# EAGLE design tick-display-mk-2.3-mini (EAGLE 6.5.0)
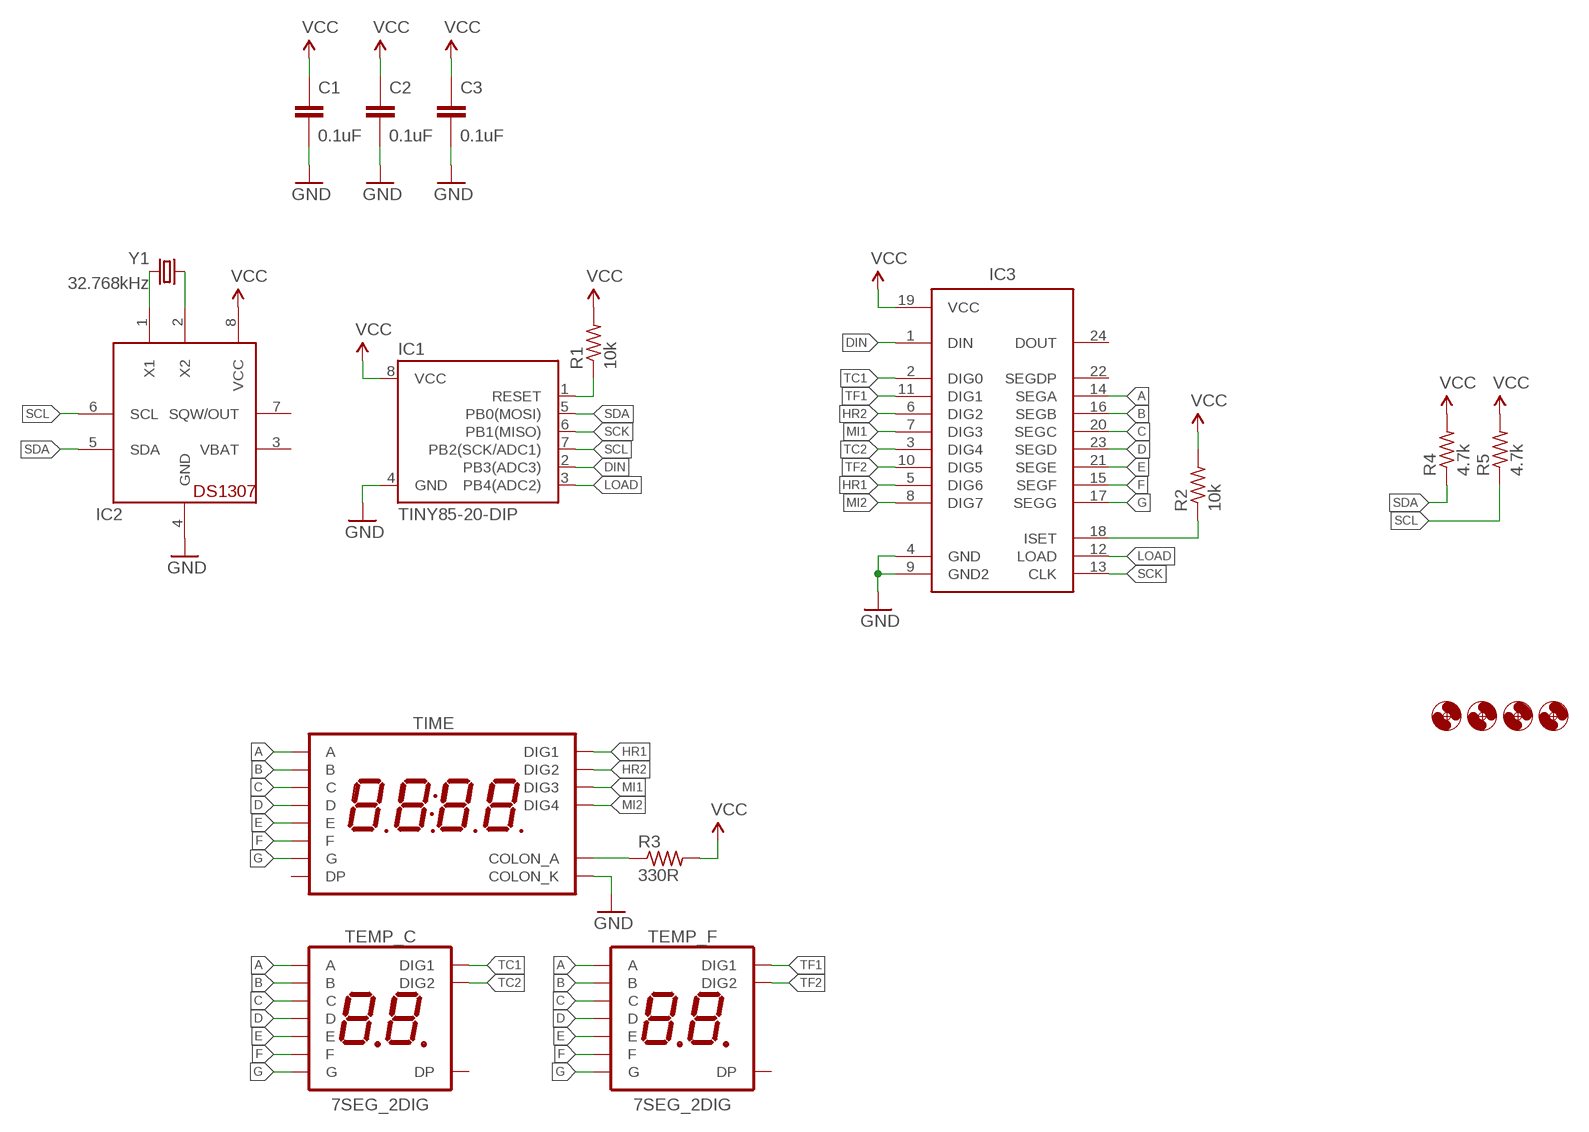
[diagram p0: schematic, sheet 1]

## Parts
C1  0.1uF  CAPACITOR-CERAMIC025-024X044  [C025-024X044]
C2  0.1uF  CAPACITOR-CERAMIC025-024X044  [C025-024X044]
C3  0.1uF  CAPACITOR-CERAMIC025-024X044  [C025-024X044]
H1  HOLE#2  [HOLE-#2]
H2  HOLE#2  [HOLE-#2]
H3  HOLE#2  [HOLE-#2]
H4  HOLE#2  [HOLE-#2]
IC1  TINY85-20-DIP  ATTINY45TINY85-20-DIP  [DIP08]
IC2  DS1307  [DIL08]
IC3  MAX7219DIP  [DIL24]
R1  10k  RESISTORPTH-AXIAL-5.08MM  [RESISTOR-AXIAL-PTH-5.08MM]
R2  10k  RESISTORPTH-AXIAL-5.08MM  [RESISTOR-AXIAL-PTH-5.08MM]
R3  330R  RESISTORPTH-AXIAL-5.08MM  [RESISTOR-AXIAL-PTH-5.08MM]
R4  4.7k  RESISTORPTH-AXIAL-5.08MM  [RESISTOR-AXIAL-PTH-5.08MM]
R5  4.7k  RESISTORPTH-AXIAL-5.08MM  [RESISTOR-AXIAL-PTH-5.08MM]
TEMP_C  7SEG_2DIG  [7SEG_2DIG_14MM]
TEMP_F  7SEG_2DIG  [7SEG_2DIG_14MM]
TIME  7SED_4DIGIT_14MM14.2MM-CC  [7SEG_4DIG]
Y1  32.768kHz  CRYSTALTC26H  [TC26H]

## Nets
A: IC3.14(SEGA) TEMP_C.4(A) TEMP_F.4(A) TIME.P$13(A)
B: IC3.16(SEGB) TEMP_C.3(B) TEMP_F.3(B) TIME.P$9(B)
C: IC3.20(SEGC) TEMP_C.9(C) TEMP_F.9(C) TIME.P$4(C)
D: IC3.23(SEGD) TEMP_C.8(D) TEMP_F.8(D) TIME.P$2(D)
DIN: IC1.2(PB3(ADC3)) IC3.1(DIN)
E: IC3.21(SEGE) TEMP_C.6(E) TEMP_F.6(E) TIME.P$1(E)
F: IC3.15(SEGF) TEMP_C.7(F) TEMP_F.7(F) TIME.P$12(F)
G: IC3.17(SEGG) TEMP_C.1(G) TEMP_F.1(G) TIME.P$5(G)
GND: C1.2 C2.2 C3.2 IC1.4(GND) IC2.4(GND) IC3.4(GND) IC3.9(GND2) TIME.P$7(COLON_K)
HR1: IC3.5(DIG6) TIME.P$14(DIG1)
HR2: IC3.6(DIG2) TIME.P$11(DIG2)
LOAD: IC1.3(PB4(ADC2)) IC3.12(LOAD)
MI1: IC3.7(DIG3) TIME.P$10(DIG3)
MI2: IC3.8(DIG7) TIME.P$6(DIG4)
N$2: IC3.18(ISET) R2.P$1
N$4: IC1.1(RESET) R1.P$1
N$7: IC2.1(X1) Y1.2
N$8: IC2.2(X2) Y1.1
N$18: R3.P$1 TIME.P$8(COLON_A)
SCK: IC1.6(PB1(MISO)) IC3.13(CLK)
SCL: IC1.7(PB2(SCK/ADC1)) IC2.6(SCL) R5.P$1
SDA: IC1.5(PB0(MOSI)) IC2.5(SDA) R4.P$1
TC1: IC3.2(DIG0) TEMP_C.5(DIG1)
TC2: IC3.3(DIG4) TEMP_C.10(DIG2)
TF1: IC3.11(DIG1) TEMP_F.5(DIG1)
TF2: IC3.10(DIG5) TEMP_F.10(DIG2)
VCC: C1.1 C2.1 C3.1 IC1.8(VCC) IC2.8(VCC) IC3.19(VCC) R1.P$2 R2.P$2 R3.P$2 R4.P$2 R5.P$2
Unconnected: IC2.7(SQW/OUT) IC3.22(SEGDP) IC3.24(DOUT) TEMP_C.2(DP) TEMP_F.2(DP) TIME.P$3(DP)

## Power pins joined to a net without a drawn wire
VBAT: IC2.3(VBAT)

## Library data of the parts
C1-C3 = A_butts:CAPACITOR-CERAMIC: CAPACITOR, European symbol
H1-H4 = A_butts:HOLE: MOUNTING HOLE with drill center marker
IC1 = A_butts:ATTINY45: Atmel 8-pin 2/4/8kB flash uC; PROD_ID: IC-09445
IC2 = A_butts:DS1307: DS1307 Real time clock (RTC) with battery backup ability. Talk to it via i2c
IC3 = A_butts:MAX7219: 8-digit, 8-segment LED display driver, serial input
R1-R5 = A_butts:RESISTOR: RESISTOR, American symbol
TEMP_C TEMP_F = A_butts:7SEG_2DIG
TIME = A_butts:7SED_4DIGIT_14MM
Y1 = A_butts:CRYSTAL: Various standard crystals. Proven footprints. Spark Fun Electronics SKU : COM-00534

## Board
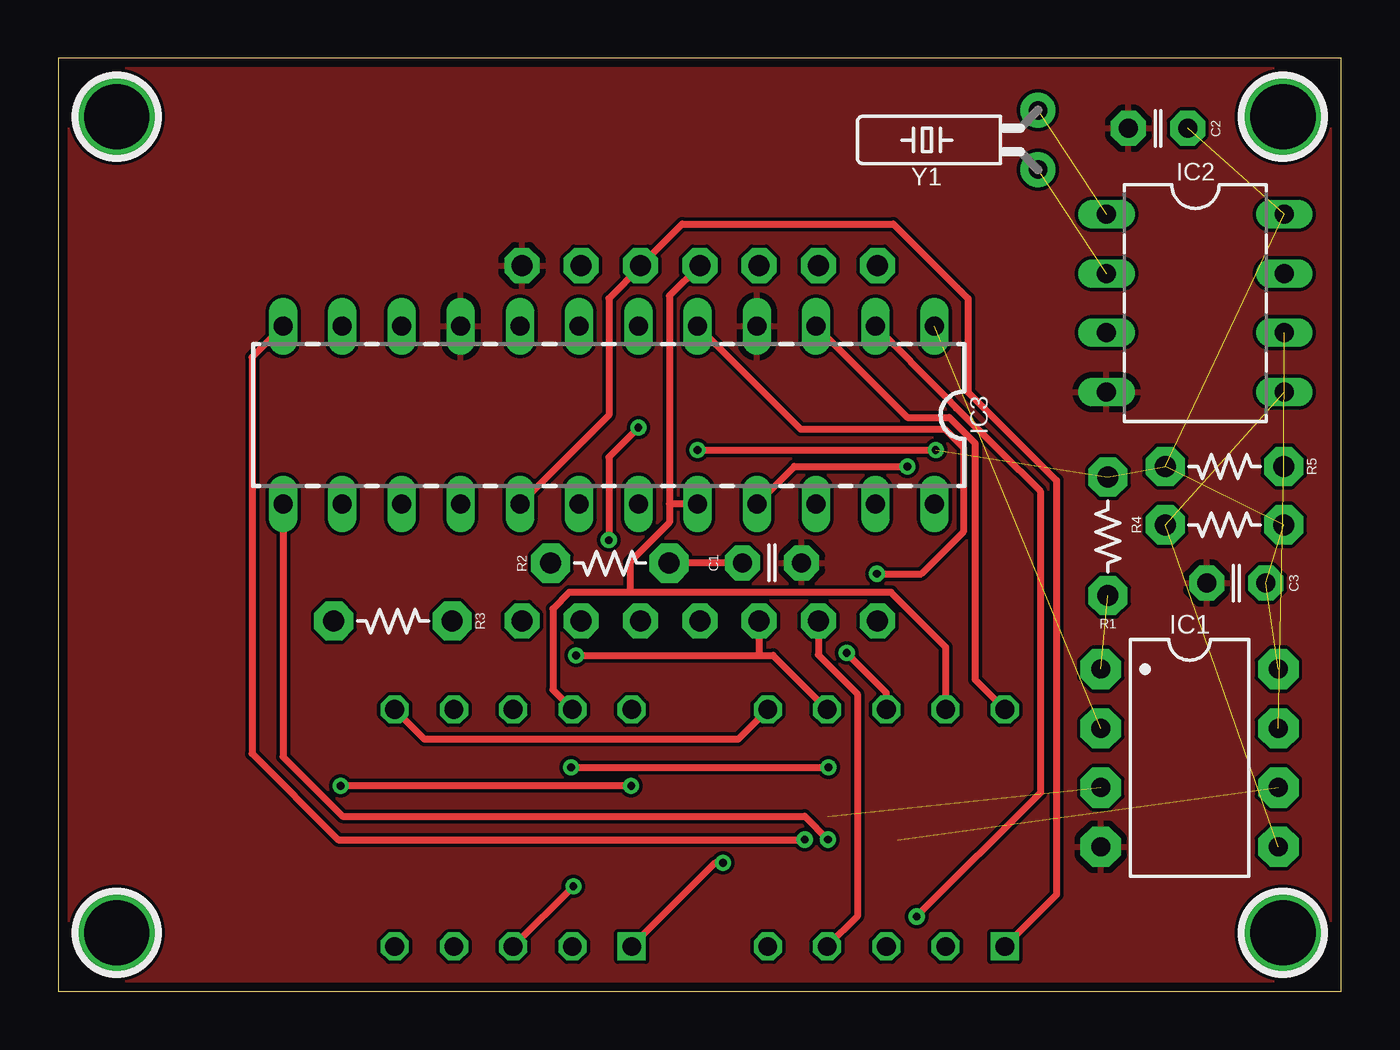
[diagram p1: board, top side]
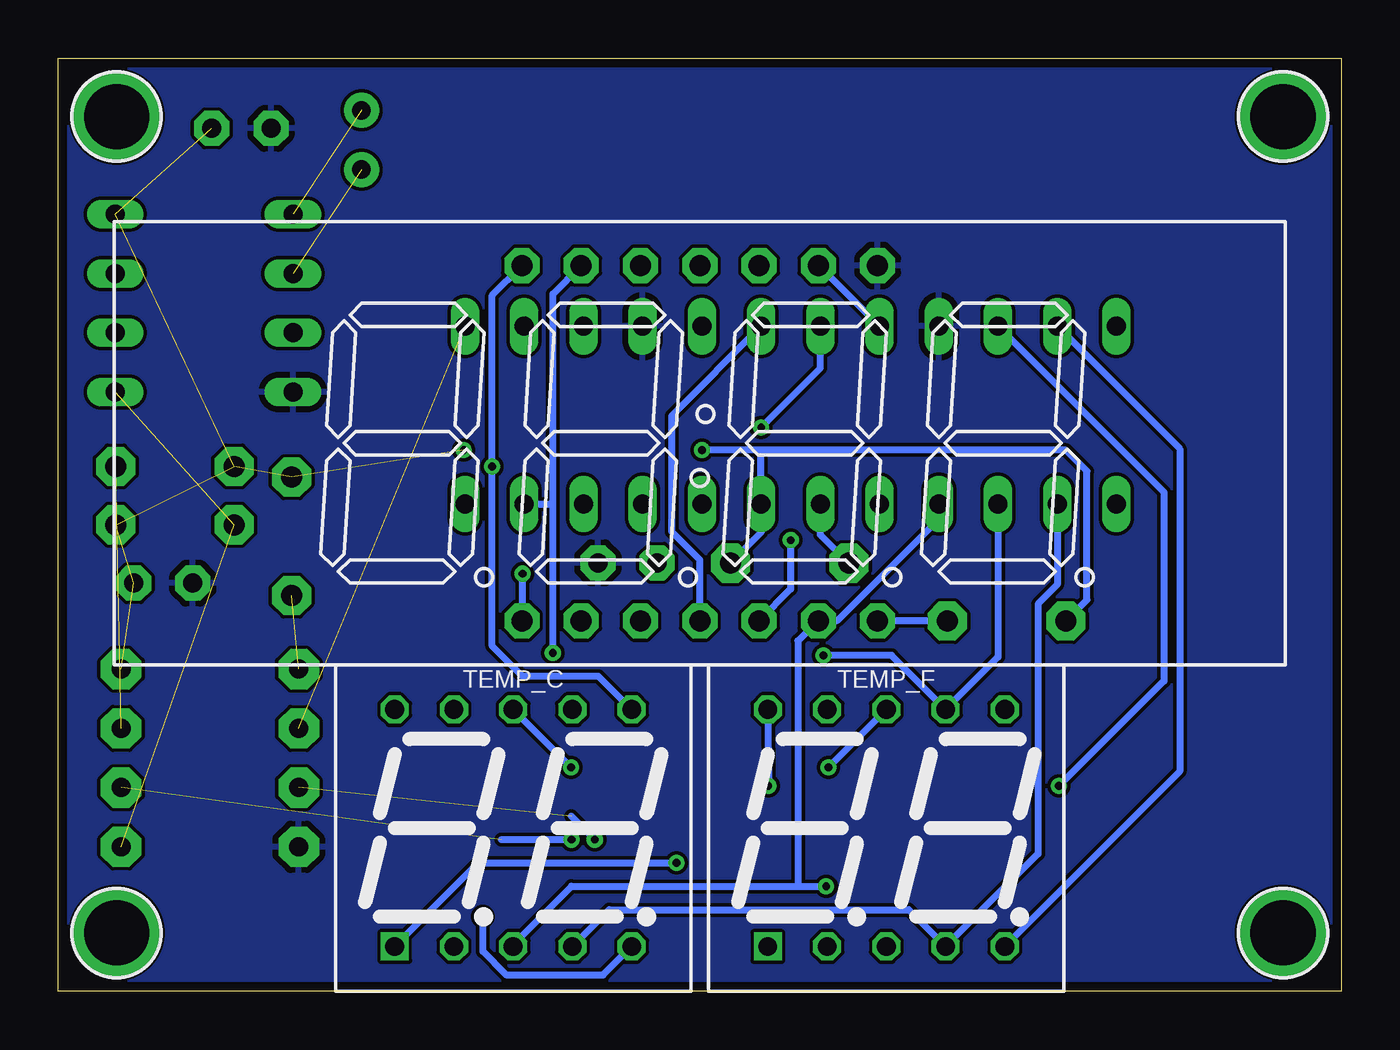
[diagram p2: board, bottom side, seen from below]

Size 55 x 40 mm. Coordinates in mm from the lower left corner, seen from the top.
Outline: 0,0 55,0 55,40 0,40 0,0
Copper layers (1*16): Top 0.0356mm / dielectric 1.5011mm / Bottom 0.0356mm
Design rules "LaenPCBOrder2": minimum track width 6mil, minimum drill 13mil, track to track 6mil, track to pad 6mil, pad to pad 6mil, via to via 6mil, smd to smd 6mil, copper to edge 15mil, drill to drill 6mil, minimum pad ring 7mil, minimum via ring 7mil, stop-mask expansion 3mil, vias tented up to drill 20mil, thermal gap 10mil

### Footprints (pad centres in the part's own frame; a part is rotated, then mirrored left to right if it is on the bottom)
C025-024X044 = drill 0.813 pad 1.5 octagon: 1 -1.27,0; 2 1.27,0
HOLE-#2 = drill 2.8 pad 3.81: P$1 0,0
DIP08 = drill 0.813 pad 1.727 octagon: 1 -3.81,-3.81; 2 -1.27,-3.81; 3 1.27,-3.81; 4 3.81,-3.81; 5 3.81,3.81; 6 1.27,3.81; 7 -1.27,3.81; 8 -3.81,3.81
DIL08 = drill 0.813 long: 1 -3.81,-3.81; 2 -1.27,-3.81; 3 1.27,-3.81; 4 3.81,-3.81; 5 3.81,3.81; 6 1.27,3.81; 7 -1.27,3.81; 8 -3.81,3.81
DIL24 = drill 0.813 long: 1 -13.97,-3.81; 2 -11.43,-3.81; 3 -8.89,-3.81; 4 -6.35,-3.81; 5 -3.81,-3.81; 6 -1.27,-3.81; 7 1.27,-3.81; 8 3.81,-3.81; 9 6.35,-3.81; 10 8.89,-3.81; 11 11.43,-3.81; 12 13.97,-3.81; 13 13.97,3.81; 14 11.43,3.81; 15 8.89,3.81; 16 6.35,3.81; 17 3.81,3.81; 18 1.27,3.81; 19 -1.27,3.81; 20 -3.81,3.81; 21 -6.35,3.81; 22 -8.89,3.81; 23 -11.43,3.81; 24 -13.97,3.81
RESISTOR-AXIAL-PTH-5.08MM = drill 0.9 pad 1.676 octagon: P$1 -2.54,0; P$2 2.54,0
7SEG_2DIG_14MM = drill 0.8 square: 1 -5.08,-5.08 | drill 0.8 octagon: 2 -2.54,-5.08; 3 0,-5.08; 4 2.54,-5.08; 5 5.08,-5.08; 6 5.08,5.08; 7 2.54,5.08; 8 0,5.08; 9 -2.54,5.08; 10 -5.08,5.08
7SEG_4DIG = drill 0.9 pad 1.5 octagon: P$1 -7.62,7.62; P$2 -5.08,7.62; P$3 -2.54,7.62; P$4 0,7.62; P$5 2.54,7.62; P$6 5.08,7.62; P$7 7.62,7.62; P$8 7.62,-7.62; P$9 5.08,-7.62; P$10 2.54,-7.62; P$11 0,-7.62; P$12 -2.54,-7.62; P$13 -5.08,-7.62; P$14 -7.62,-7.62
TC26H = drill 0.8 pad 1.5: 1 -1.27,0; 2 1.27,0

### Placement (x,y rotation side)
C1  30.6,18.37 0 top
C2  47.15,37 180 top
C3  50.5,17.5 180 top
H1  2.5,37.5 0 top
H2  52.5,37.5 0 top
H3  2.5,2.5 0 top
H4  52.5,2.5 0 top
IC1  48.5,10 270 top
IC2  48.75,29.5 270 top
IC3  23.6,24.7 180 top
R1  45,19.5 90 top
R2  23.65,18.35 0 top
R3  14.35,15.87 180 top
R4  50,20 0 top
R5  50,22.5 180 top
TEMP_C  35.5,7 0 bottom
TEMP_F  19.5,7 0 bottom
TIME  27.5,23.5 0 bottom
Y1  42,36.5 90 top

### Tracks (layer width: path | path; a pad name or v marks a point on that pad's centre or on a via)
A
  Top 0.305: TIME.P$13 32.58,14.42 34.25,12.75 34.25,3.21 TEMP_C.4
  Bottom 0.305: TEMP_C.4 31.38,3.5 18.54,3.5 TEMP_F.4 13,5.88 13,16.6 12.17,17.43 IC3.14
B  (via drill 0.33)
  Top 0.305: v22.08,4.5 TEMP_F.3
  Bottom 0.305: TEMP_C.3 35.5,2 33,4.5 23.3,4.5 | 23.3,4.5 v22.08,4.5 | 23.3,4.5 23.3,15.02 22.42,15.9 TIME.P$9 21.62,15.88 17.25,20.25 IC3.16
C
  Top 0.305: TIME.P$4 26.2,29.82 26.2,20.89 | 26.2,20.89 26.2,20.1 24.5,18.4 24.5,17.2 24.6,17.1 | TEMP_F.9 21.2,12.92 21.2,16.4 21.9,17.1 24.6,17.1 | TEMP_C.9 38.04,14.76 35.7,17.1 24.6,17.1 | IC3.20 26.2,20.89
D  (via drill 0.33)
  Top 0.305: TEMP_C.8 35.5,12.8 v33.8,14.5 | v21.98,9.6 v33.02,9.6
  Bottom 0.305: v33.8,14.5 33.8,20.89 | 33.8,20.89 33.8,29.9 TIME.P$2 | TEMP_F.8 v21.98,9.6 | v33.02,9.6 TEMP_C.8 | IC3.23 33.8,20.89
DIN  (1 unrouted)
E  (via drill 0.33)
  Top 0.305: TEMP_C.6 29.14,10.8 15.7,10.8 TEMP_F.6 | IC3.21 31.56,22.5 v36.4,22.5
  Bottom 0.305: TEMP_C.6 31.84,13.5 35.1,13.5 36.4,14.8 v36.4,22.5 36.4,29.84 TIME.P$1
F  (via drill 0.33)
  Top 0.305: v22.2,14.4 30.04,14.4 | 30.04,14.4 30.64,14.4 TEMP_C.7 | TIME.P$12 30.04,14.4
  Bottom 0.305: v22.2,14.4 19.28,14.4 TEMP_F.7 14.71,14.33 IC3.15
G  (via drill 0.33)
  Top 0.305: v28.5,5.5 28.16,5.5 TEMP_F.1 | TEMP_C.1 42.8,4.14 42.8,21.9 39,25.7 39,29.7 35.8,32.9 26.74,32.9 TIME.P$5 24.96,31.06 23.6,29.7 23.6,24.7 IC3.17
  Bottom 0.305: TEMP_C.1 37,5.5 v28.5,5.5
GND
  pour Top: 0,0 0,40 55,40 55,0
  pour Bottom: 0,0 0,40 55,40 55,0
HR1  (via drill 0.33)
  Top 0.305: v35.1,17.9 37,17.9 38.8,19.7 38.8,23.3 38,24.1 31.82,24.1 IC3.5
  Bottom 0.305: TIME.P$14 35.1,15.9 v35.1,17.9
HR2
  Bottom 0.305: TIME.P$11 27.5,18.5 28.7,19.7 28.7,24.68 IC3.6
LOAD  (via drill 0.33)  (1 unrouted)
  Top 0.305: IC3.12 8.3,27.18 8.3,10.19 11.99,6.5 v32,6.5
  Bottom 0.305: v32,6.5 33,7.5
MI1  (via drill 0.33)
  Top 0.305: v24.87,24.17 23.6,22.9 v23.6,19.34
  Bottom 0.305: v23.6,19.34 23.6,17.24 TIME.P$10 | v24.87,24.17 22.33,26.71 IC3.7
MI2
  Bottom 0.305: TIME.P$6 22.4,31.12 IC3.8
N$2
  Bottom 0.305: R2.P$1 22.33,19.57 IC3.18
N$4  (1 unrouted)
N$7  (1 unrouted)
N$8  (1 unrouted)
N$18
  Bottom 0.305: R3.P$1 TIME.P$8
SCK  (via drill 0.33)  (1 unrouted)
  Top 0.305: IC3.13 9.63,10.05 12.18,7.5 32,7.5 v33,6.5
  Bottom 0.305: v33,6.5 36,6.5
SCL  (2 unrouted)
SDA  (2 unrouted)
TC1  (via drill 0.33)
  Top 0.305: IC3.2 38.03,25.5 38.5,25 42.1,21.44 42.1,8.5 v36.8,3.2
  Bottom 0.305: TEMP_C.5 31.64,0.7 35.8,0.7 36.8,1.7 v36.8,3.2
TC2
  Top 0.305: IC3.3 36.4,24.6 38.2,24.6 39.3,23.5 39.3,13.36 TEMP_C.10
  Bottom 0.305: TEMP_C.10 40.6,12.1
TF1
  Bottom 0.305: TEMP_F.5 6.92,9.42 6.92,23.26 IC3.11
TF2  (via drill 0.33)
  Top 0.305: v24.56,8.8 v12.1,8.8
  Bottom 0.305: TEMP_F.10 v24.56,8.8 | IC3.10 7.6,21.4 7.6,13.3 v12.1,8.8
VCC  (via drill 0.33)  (7 unrouted)
  Top 0.305: v27.4,23.2 v37.62,23.2 | C1.1 29.31,18.35 R2.P$2
  Bottom 0.305: R3.P$2 10.9,16.78 10.9,22.3 11.8,23.2 24.9,23.2 | 24.9,23.2 v27.4,23.2 | 24.9,23.2 24.87,23.17 IC3.19 24.87,19.67 R2.P$2